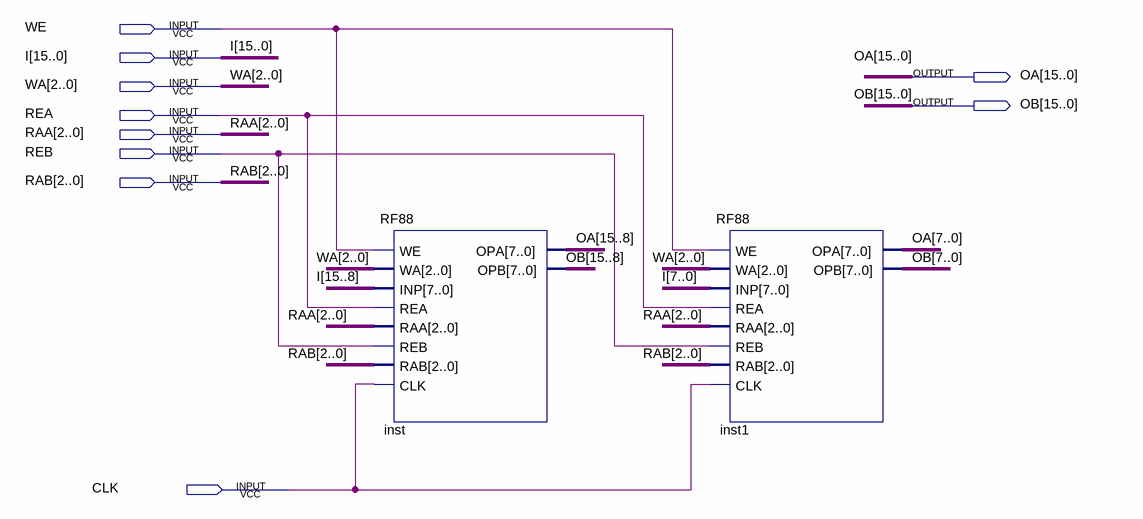
[diagram p0: schematic sheet]
// Quartus schematic RF816.bdf as structural Verilog: 2 symbols, 10 pins
module RF816 (
  input  WE,
  input  [15:0] I,
  input  [2:0] WA,
  input  REA,
  input  [2:0] RAA,
  input  REB,
  input  [2:0] RAB,
  input  CLK,
  output [15:0] OA,
  output [15:0] OB
);

  RF88 inst (
    .WE(WE), .WA(WA), .INP(I[15:8]), .REA(REA), .RAA(RAA), .REB(REB), .RAB(RAB), .CLK(CLK), .OPA(OA[15:8]),
    .OPB(OB[15:8]));
  RF88 inst1 (
    .WE(WE), .WA(WA), .INP(I[7:0]), .REA(REA), .RAA(RAA), .REB(REB), .RAB(RAB), .CLK(CLK), .OPA(OA[7:0]),
    .OPB(OB[7:0]));
endmodule
